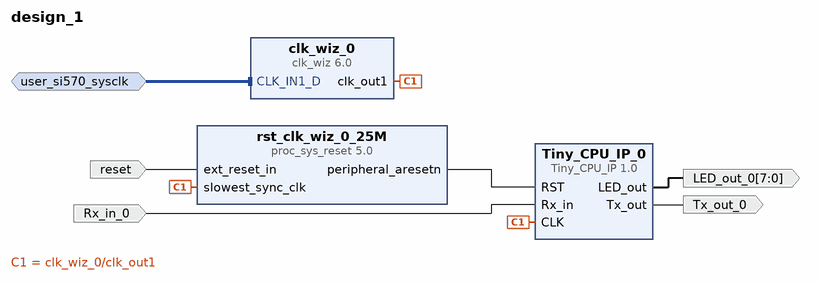
[diagram p0: block diagram of the top level]
# Vivado block design design_1, xczu9eg-ffvb1156-2-e, Vivado 2022.2.2
create_bd_design design_1

create_bd_intf_port -mode Slave -vlnv xilinx.com:interface:diff_clock_rtl:1.0 user_si570_sysclk
set_property -dict {CONFIG.FREQ_HZ 300000000} [get_bd_intf_ports user_si570_sysclk]
create_bd_port -dir I -type rst reset
set_property -dict {CONFIG.POLARITY ACTIVE_HIGH} [get_bd_ports reset]
create_bd_port -dir O -from 7 -to 0 LED_out_0
create_bd_port -dir O Tx_out_0
create_bd_port -dir I Rx_in_0

create_bd_cell -type ip -vlnv xilinx.com:ip:clk_wiz:6.0 clk_wiz_0
set_property -dict [list \
  CONFIG.CLKIN1_JITTER_PS 33.330000000000005 \
  CONFIG.CLKOUT1_JITTER 241.628 \
  CONFIG.CLKOUT1_PHASE_ERROR 226.541 \
  CONFIG.CLKOUT1_REQUESTED_OUT_FREQ 25.000 \
  CONFIG.CLK_IN1_BOARD_INTERFACE user_si570_sysclk \
  CONFIG.MMCM_CLKFBOUT_MULT_F 44.375 \
  CONFIG.MMCM_CLKIN1_PERIOD 3.333 \
  CONFIG.MMCM_CLKIN2_PERIOD 10.0 \
  CONFIG.MMCM_CLKOUT0_DIVIDE_F 44.375 \
  CONFIG.MMCM_DIVCLK_DIVIDE 12 \
  CONFIG.PRIM_SOURCE Differential_clock_capable_pin \
  CONFIG.USE_BOARD_FLOW true \
  CONFIG.USE_LOCKED false \
  CONFIG.USE_RESET false \
] [get_bd_cells clk_wiz_0]
create_bd_cell -type ip -vlnv xilinx.com:ip:proc_sys_reset:5.0 rst_clk_wiz_0_25M
set_property -dict {CONFIG.RESET_BOARD_INTERFACE reset CONFIG.USE_BOARD_FLOW true} [get_bd_cells rst_clk_wiz_0_25M]
create_bd_cell -type ip -vlnv comparch:user:Tiny_CPU_IP:1.0 Tiny_CPU_IP_0

# ---- connections ----

connect_bd_intf_net [get_bd_intf_ports user_si570_sysclk] [get_bd_intf_pins clk_wiz_0/CLK_IN1_D]
connect_bd_net -net Rx_in_0_1 [get_bd_ports Rx_in_0] [get_bd_pins Tiny_CPU_IP_0/Rx_in]
connect_bd_net [get_bd_pins Tiny_CPU_IP_0/LED_out] [get_bd_ports LED_out_0]
connect_bd_net [get_bd_pins Tiny_CPU_IP_0/Tx_out] [get_bd_ports Tx_out_0]
connect_bd_net [get_bd_pins clk_wiz_0/clk_out1] [get_bd_pins rst_clk_wiz_0_25M/slowest_sync_clk] [get_bd_pins Tiny_CPU_IP_0/CLK]
connect_bd_net [get_bd_ports reset] [get_bd_pins rst_clk_wiz_0_25M/ext_reset_in]
connect_bd_net [get_bd_pins rst_clk_wiz_0_25M/peripheral_aresetn] [get_bd_pins Tiny_CPU_IP_0/RST]

validate_bd_design
save_bd_design
